# EAGLE design Opamp Boost Pedal (EAGLE 6.5.0)
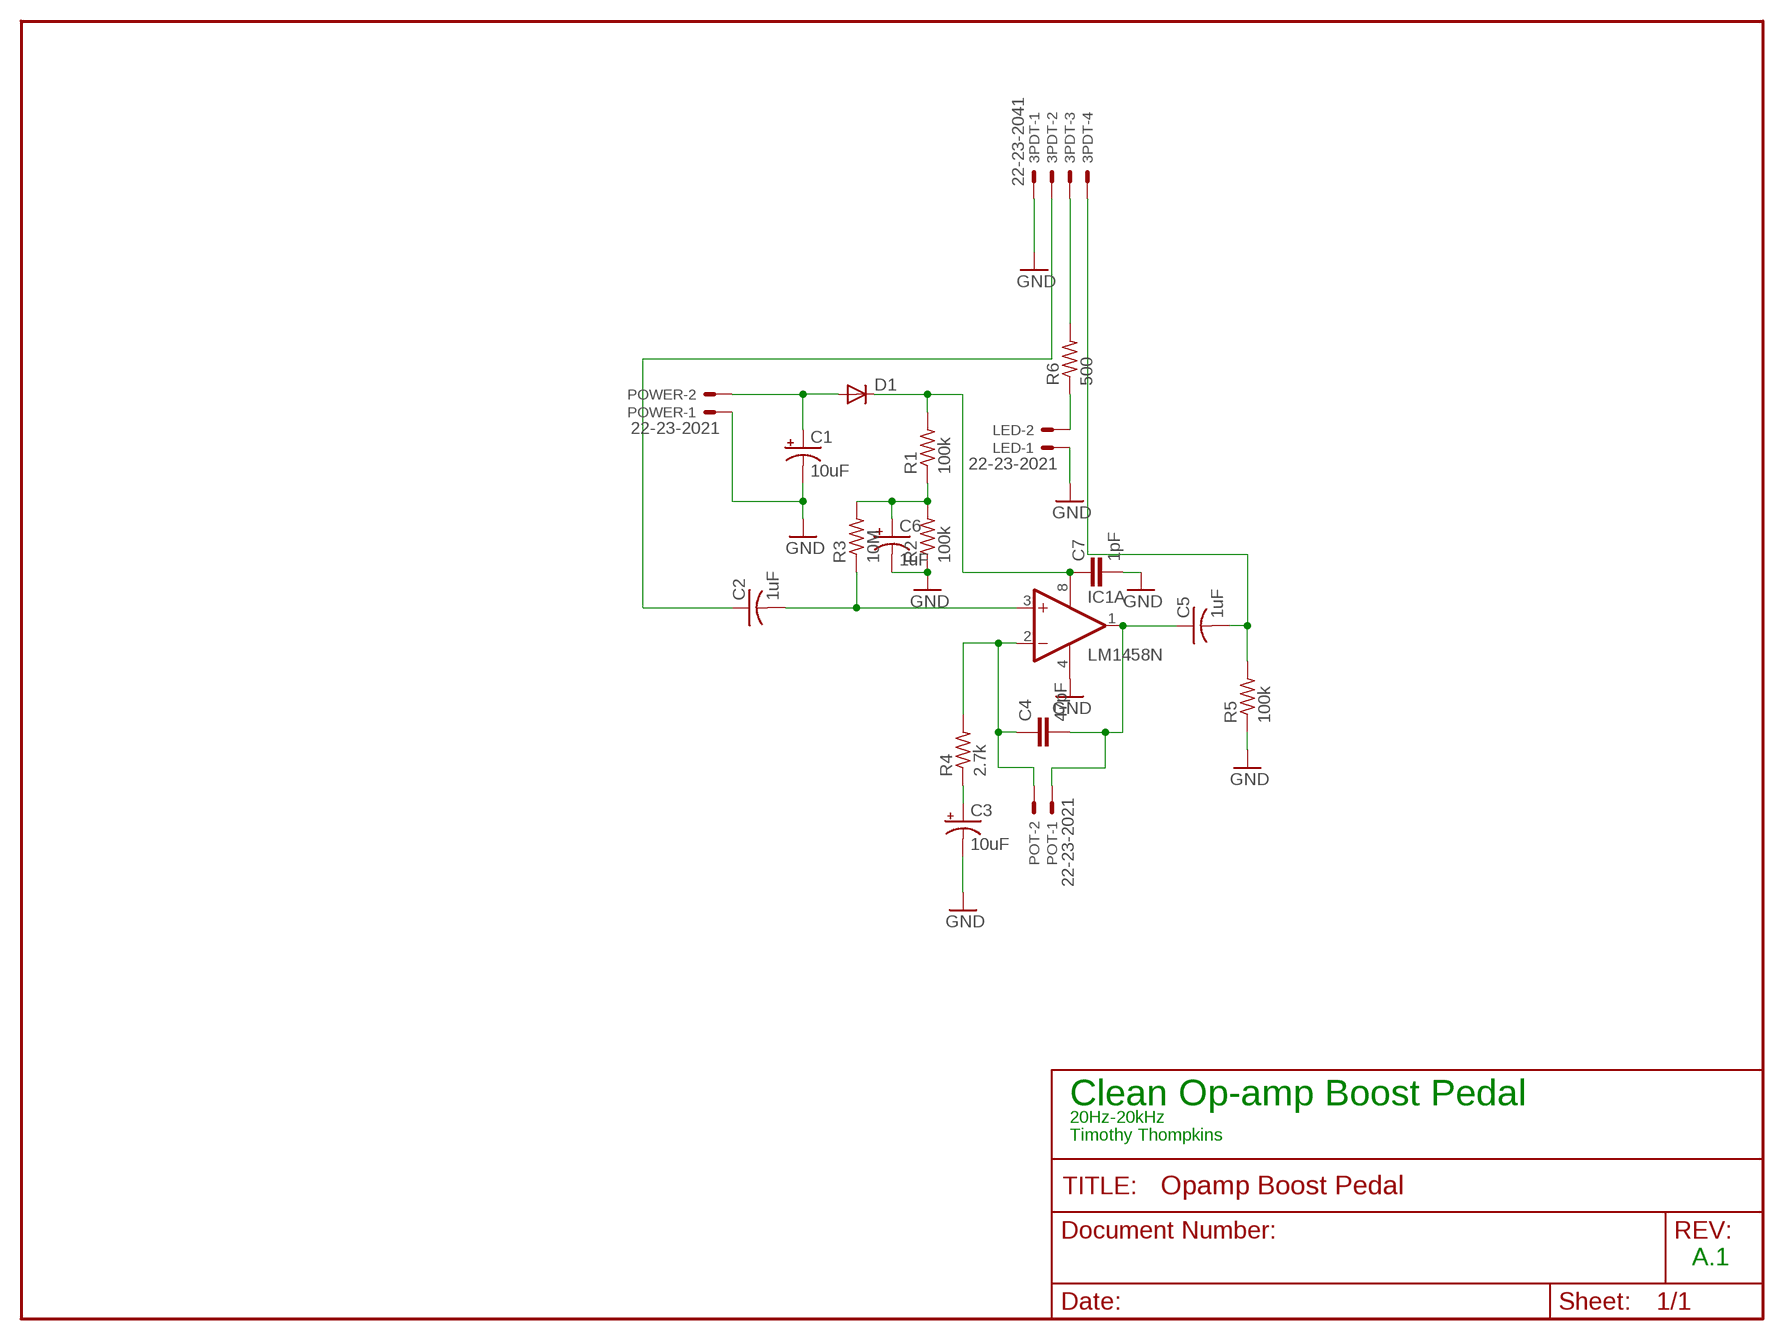
[diagram p0: schematic, sheet 1]

## Parts
3PDT  22-23-2041  [22-23-2041]
C1  10uF  CPOL-USE5-5  [E5-5]
C2  1uF  C-US050-045X075  [C050-045X075]
C3  10uF  CPOL-USE5-5  [E5-5]
C4  47pF  C2.5/2  [C2.5-2]
C5  1uF  C-US050-045X075  [C050-045X075]
C6  1uF  CPOL-USE5-5  [E5-5]
C7  1pF  C2.5/2  [C2.5-2]
D1  DIODE-D-2.5  [D-2.5]
IC1  LM1458N  [DIL08]
LED  22-23-2021  [22-23-2021]
POT  22-23-2021  [22-23-2021]
POWER  22-23-2021  [22-23-2021]
R1  100k  R-US_0207/2V  [0207/2V]
R2  100k  R-US_0207/2V  [0207/2V]
R3  10M  R-US_0207/2V  [0207/2V]
R4  2.7k  R-US_0207/2V  [0207/2V]
R5  100k  R-US_0207/2V  [0207/2V]
R6  500  R-US_0207/2V  [0207/2V]

## Nets
GND: 3PDT.1 C1.- C3.- C6.- C7.2 IC1.4(P:V-) LED.1 POWER.1 R2.1 R5.1
N$1: C2.2 IC1.3(A:+IN) R3.1
N$2: 3PDT.3 R6.2
N$3: C7.1 D1.C IC1.8(P:V+) R1.2
N$4: C1.+ D1.A POWER.2
N$5: LED.2 R6.1
N$6: C3.+ R4.1
N$7: C4.1 IC1.2(A:-IN) POT.2 R4.2
N$8: C4.2 C5.1 IC1.1(A:OUT) POT.1
N$9: 3PDT.4 C5.2 R5.2
N$10: 3PDT.2 C2.1
N$11: C6.+ R1.1 R2.2 R3.2
Unconnected: IC1.5(B:+IN) IC1.6(B:-IN) IC1.7(B:OUT)

## Notes on the sheet
- Clean Op-amp Boost Pedal
- 20Hz-20kHz
- Timothy Thompkins
- A.1

## Library data of the parts
3PDT = con-molex:22-23-2041: .100" (2.54mm) Center Header - 4 Pin
C1 C3 C6 = resistor:CPOL-US: POLARIZED CAPACITOR, American symbol
C2 C5 = resistor:C-US: CAPACITOR, American symbol
C4 C7 = capacitor-wima:C: CAPACITOR naming: grid - package width
D1 = diode:DIODE-: DIODE
IC1 = linear:*1458: OP AMP
LED POT POWER = con-molex:22-23-2021: .100" (2.54mm) Center Header - 2 Pin
R1-R6 = resistor:R-US_: RESISTOR, American symbol

## Board
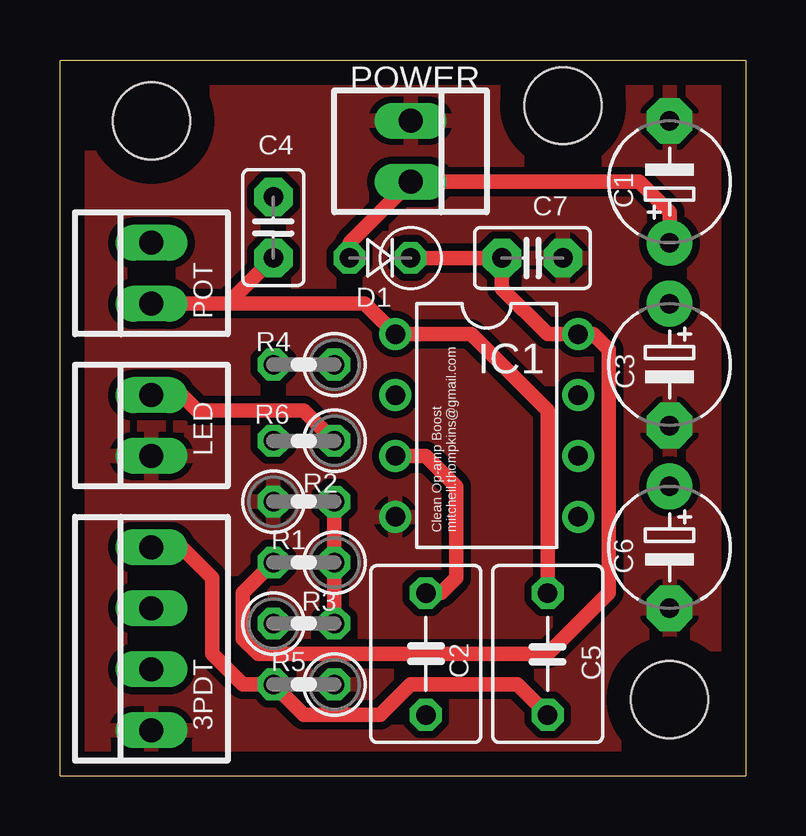
[diagram p1: board, top side]
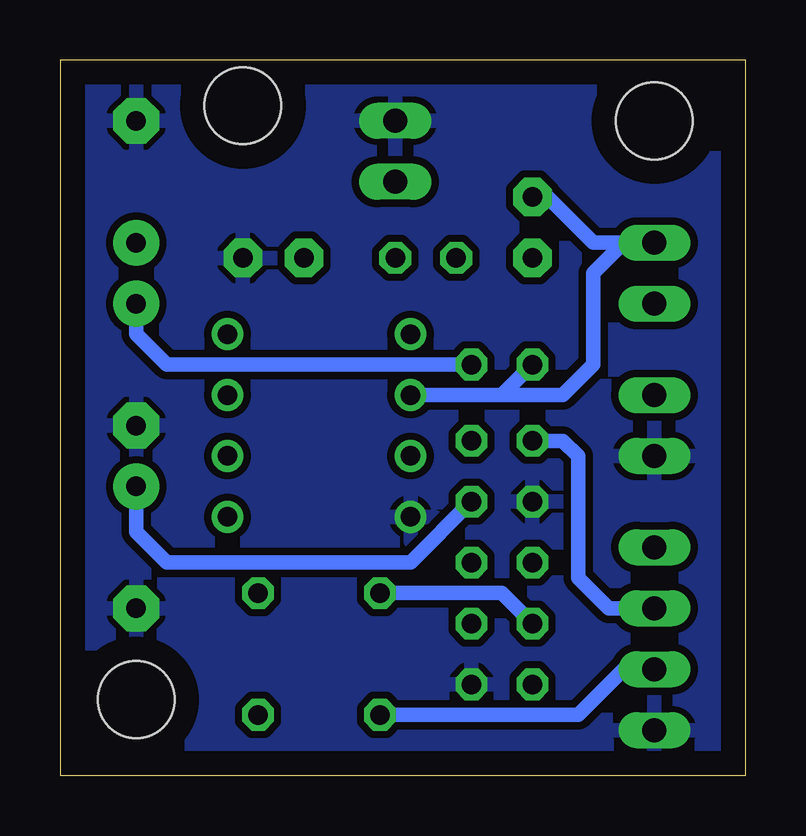
[diagram p2: board, bottom side, seen from below]

Size 28.57 x 29.84 mm. Coordinates in mm from the lower left corner, seen from the top.
Outline: 0,0 0,29.84 28.57,29.84 28.57,0 0,0
Copper layers (1*16): Top 0.035mm / dielectric 1.5mm / Bottom 0.035mm
Design rules "default *": minimum track width 10mil, minimum drill 24mil, track to track 12mil, track to pad 12mil, pad to pad 12mil, via to via 8mil, smd to smd 8mil, copper to edge 40mil, drill to drill 8mil, minimum pad ring 10mil, minimum via ring 8mil, stop-mask expansion 4mil, vias tented up to drill 0mil, thermal gap 10mil
Holes 3.2 mm at 25.4,3.17 20.95,27.94 3.81,27.3

### Footprints (pad centres in the part's own frame; a part is rotated, then mirrored left to right if it is on the bottom)
22-23-2041 = drill 1 long: 1 -3.81,0; 2 -1.27,0; 3 1.27,0; 4 3.81,0
E5-5 = drill 0.813 pad 1.905: + -2.54,0 | drill 0.813 pad 1.905 octagon: - 2.54,0
C050-045X075 = drill 0.813 octagon: 1 -2.54,0; 2 2.54,0
C2.5-2 = drill 0.813 pad 1.6 octagon: 1 -1.27,0; 2 1.27,0
D-2.5 = drill 0.813 octagon: A 1.27,0; C -1.27,0
DIL08 = drill 0.813 pad 1.27: 1 -3.81,-3.81; 2 -1.27,-3.81; 3 1.27,-3.81; 4 3.81,-3.81; 5 3.81,3.81; 6 1.27,3.81; 7 -1.27,3.81; 8 -3.81,3.81
22-23-2021 = drill 1 long: 1 -1.27,0; 2 1.27,0
0207/2V = drill 0.813 octagon: 1 -1.27,0; 2 1.27,0

### Placement (x,y rotation side)
3PDT  3.81,5.71 90 top
C1  25.4,24.77 90 top
C2  15.24,5.08 90 top
C3  25.4,17.14 270 top
C4  8.89,22.86 270 top
C5  20.32,5.08 270 top
C6  25.4,9.53 270 top
C7  19.68,21.59 0 top
D1  13.34,21.59 180 top
IC1  17.78,14.61 270 top
LED  3.81,14.61 90 top
POT  3.81,20.95 90 top
POWER  14.61,26.04 270 top
R1  10.16,8.89 180 top
R2  10.16,11.43 0 top
R3  10.16,6.35 0 top
R4  10.16,17.14 180 top
R5  10.16,3.81 180 top
R6  10.16,13.97 180 top

### Tracks (layer width: path | path; a pad name or v marks a point on that pad's centre or on a via)
GND
  pour Top: 0,0 28.57,0 28.57,29.84 0,29.84
  pour Bottom: 0,29.84 28.57,29.84 28.57,0 0,0
N$1
  Top 0.61: IC1.3 15.24,13.34 16.51,12.06 16.51,8.26 15.88,7.62 C2.2
  Bottom 0.61: R3.1 10.16,7.62 C2.2
N$2
  Bottom 0.61: 3PDT.3 5.71,6.99 6.99,8.26 6.99,13.34 7.62,13.97 R6.2
N$3
  Top 0.61: R1.2 7.62,7.62 7.62,5.71 8.26,5.08 20.32,5.08 22.86,7.62 22.86,17.78 22.23,18.41 IC1.8 20.32,18.41 18.41,20.32 C7.1 D1.C
N$4
  Top 0.61: D1.A 12.06,22.23 POWER.2 24.13,24.77 25.4,23.5 C1.+
N$5
  Top 0.61: R6.1 10.16,15.24 5.71,15.24 5.08,15.88 LED.2
N$6
  Bottom 0.61: R4.1 24.13,17.14 25.4,18.41 C3.+
N$7
  Bottom 0.61: POT.2 5.08,22.23 | 5.08,22.23 6.35,20.95 6.35,17.14 7.62,15.88 10.16,15.88 | 10.16,15.88 IC1.2 | R4.2 10.16,15.88 | 5.08,22.23 6.35,22.23 8.26,24.13 C4.1
N$8
  Top 0.61: C5.1 20.32,15.24 17.14,18.41 IC1.1 12.7,19.68 6.99,19.68 | POT.1 6.35,19.68 6.99,19.68 | C4.2 6.99,19.68
N$9
  Top 0.61: C5.2 19.05,3.81 14.61,3.81 13.34,2.54 10.16,2.54 R5.2 7.62,3.81 6.35,5.08 6.35,8.26 5.08,9.53 3PDT.4
N$10
  Bottom 0.61: C2.1 6.99,2.54 5.08,4.45 3PDT.2
N$11
  Top 0.61: R3.2 R1.1 R2.2
  Bottom 0.61: R2.2 13.97,8.89 24.13,8.89 25.4,10.16 C6.+

### Text on the board
tNames: Clean Op-amp Boost / mitchell.thompkins@gmail.com